# Altium schematic sheet ESP8266_Sheet.SchDoc
size A
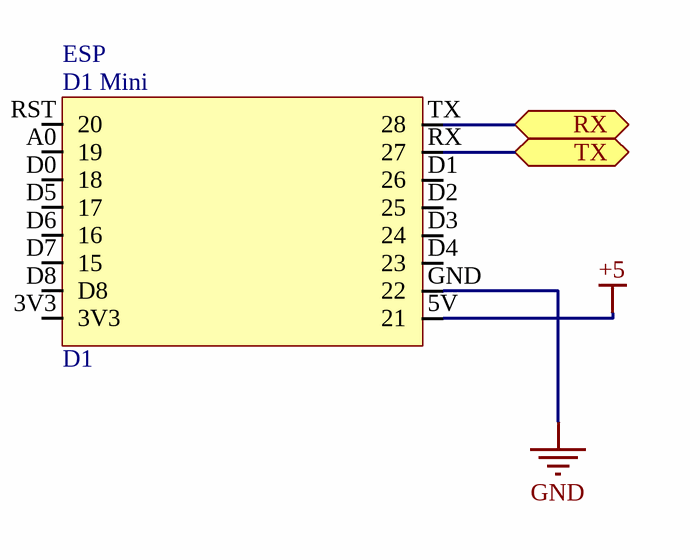
[diagram p0: ESP8266_Sheet.SchDoc]

## Parts
ESP  D1  [WEMOS_D1_MINI]

## Ports
RX (bidir), TX (bidir)

## Nets
+5: ESP.5V(21)
GND: ESP.GND(22)
RX: ESP.TX(28) ; port RX
TX: ESP.RX(27) ; port TX

Not connected (* = marked no-connect by the designer): ESP 3V3 A0(19) D0(18) D1(26) D2(25) D3(24) D4(23) D5(17) D6(16) D7(15) D8 RST(20)

## Notes on the sheet
- (in symbol WEMOS_D1_MINI) D1 Mini

## Library data of the parts
ESP = WEMOS_D1_MINI